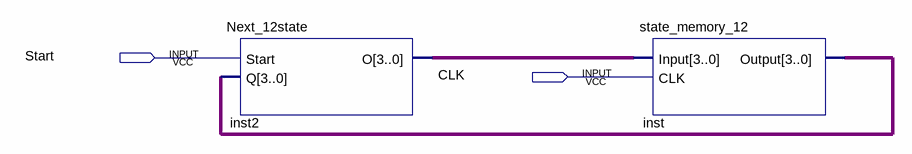
[diagram p0: schematic sheet]
// Quartus schematic Controller_version5.bdf as structural Verilog: 2 symbols, 2 pins
module Controller_version5 (
  input  Start,
  input  CLK
);

  wire [3:0] inst2_o, inst_output;

  Next_12state inst2 (.Start(Start), .Q(inst_output), .O(inst2_o));
  state_memory_12 inst (.Input(inst2_o), .CLK(CLK), .Output(inst_output));
endmodule
